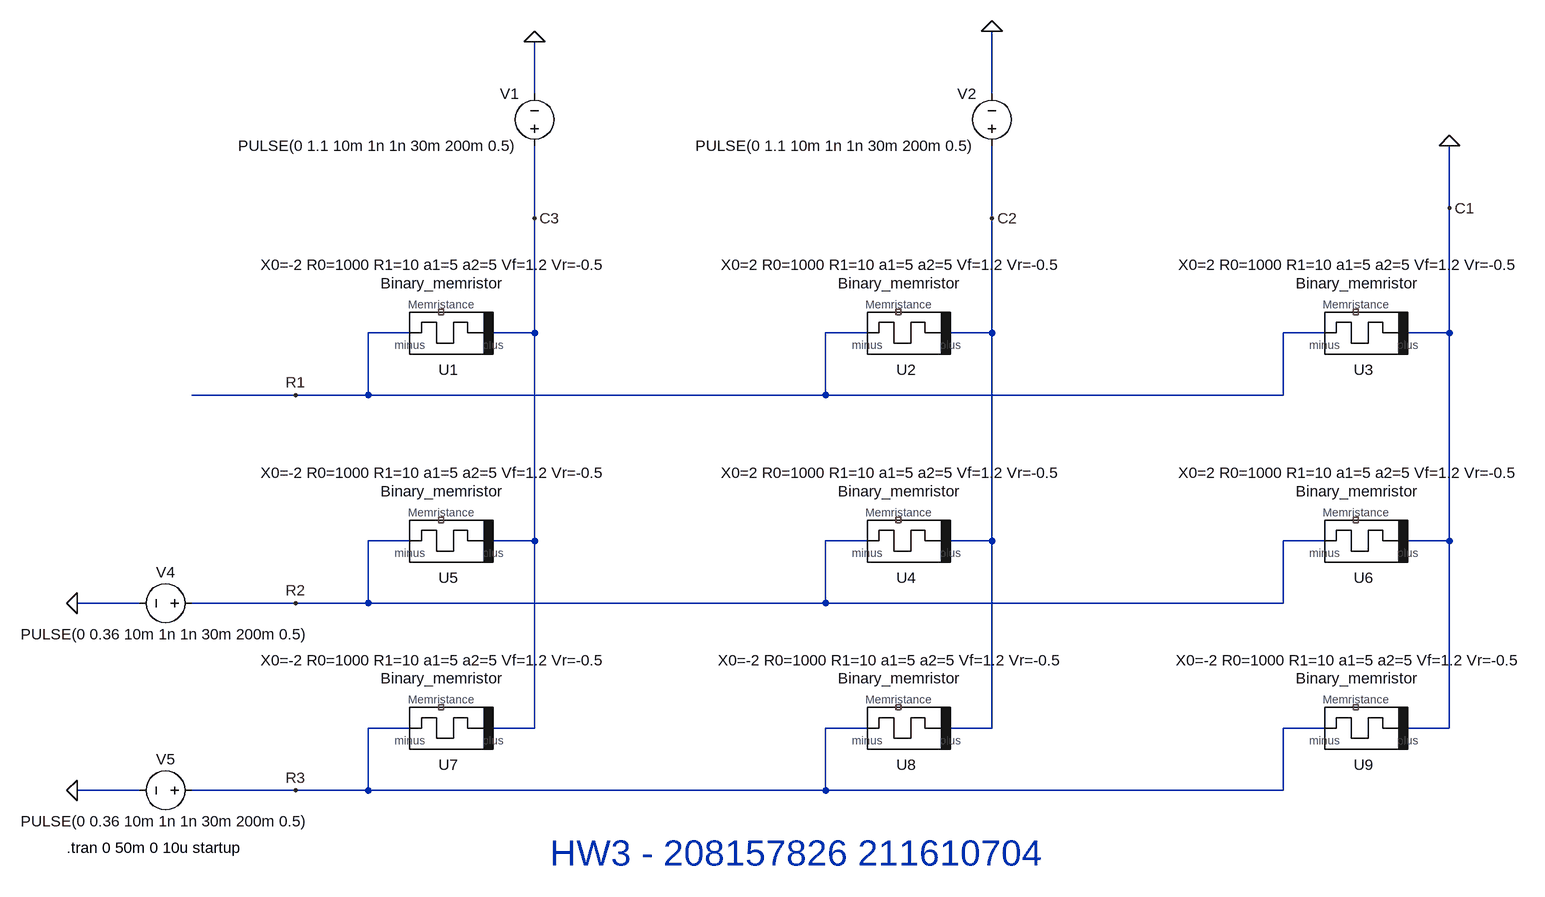
[diagram p0: schematic Q2_part_d.asc]
Q2_part_d.asc, the LTspice schematic file:
Version 4
SHEET 1 1956 900
WIRE 400 -304 400 -384
WIRE 1104 -304 1104 -400
WIRE 1808 -128 1808 -224
WIRE 400 -112 400 -224
WIRE 1104 -112 1104 -224
WIRE 208 64 144 64
WIRE 400 64 400 -112
WIRE 400 64 336 64
WIRE 912 64 848 64
WIRE 1104 64 1104 -112
WIRE 1104 64 1040 64
WIRE 1616 64 1552 64
WIRE 1808 64 1808 -128
WIRE 1808 64 1744 64
WIRE 32 160 -128 160
WIRE 144 160 144 64
WIRE 144 160 32 160
WIRE 848 160 848 64
WIRE 848 160 144 160
WIRE 1552 160 1552 64
WIRE 1552 160 848 160
WIRE 208 384 144 384
WIRE 400 384 400 64
WIRE 400 384 336 384
WIRE 912 384 848 384
WIRE 1104 384 1104 64
WIRE 1104 384 1040 384
WIRE 1616 384 1552 384
WIRE 1808 384 1808 64
WIRE 1808 384 1744 384
WIRE -208 480 -304 480
WIRE 32 480 -128 480
WIRE 144 480 144 384
WIRE 144 480 32 480
WIRE 848 480 848 384
WIRE 848 480 144 480
WIRE 1552 480 1552 384
WIRE 1552 480 848 480
WIRE 208 672 144 672
WIRE 400 672 400 384
WIRE 400 672 336 672
WIRE 912 672 848 672
WIRE 1104 672 1104 384
WIRE 1104 672 1040 672
WIRE 1616 672 1552 672
WIRE 1808 672 1808 384
WIRE 1808 672 1744 672
WIRE -208 768 -304 768
WIRE 32 768 -128 768
WIRE 144 768 144 672
WIRE 144 768 32 768
WIRE 848 768 848 672
WIRE 848 768 144 768
WIRE 1552 768 1552 672
WIRE 1552 768 848 768
FLAG 1808 -224 0
FLAG -304 480 0
FLAG -304 768 0
FLAG 400 -384 0
FLAG 1104 -400 0
FLAG 32 160 R1
FLAG 32 480 R2
FLAG 32 768 R3
FLAG 400 -112 C3
FLAG 1104 -112 C2
FLAG 1808 -128 C1
SYMBOL Binary 256 64 R180
SYMATTR InstName U1
SYMATTR SpiceLine X0=-2 R0=1000 R1=10 a1=5 a2=5 Vf=1.2 Vr=-0.5
SYMBOL Binary 960 64 R180
SYMATTR InstName U2
SYMATTR SpiceLine X0=2 R0=1000 R1=10 a1=5 a2=5 Vf=1.2 Vr=-0.5
SYMBOL Binary 1664 64 R180
SYMATTR InstName U3
SYMATTR SpiceLine X0=2 R0=1000 R1=10 a1=5 a2=5 Vf=1.2 Vr=-0.5
SYMBOL Binary 960 384 R180
SYMATTR InstName U4
SYMATTR SpiceLine X0=2 R0=1000 R1=10 a1=5 a2=5 Vf=1.2 Vr=-0.5
SYMBOL Binary 256 384 R180
SYMATTR InstName U5
SYMATTR SpiceLine X0=-2 R0=1000 R1=10 a1=5 a2=5 Vf=1.2 Vr=-0.5
SYMBOL Binary 1664 384 R180
SYMATTR InstName U6
SYMATTR SpiceLine X0=2 R0=1000 R1=10 a1=5 a2=5 Vf=1.2 Vr=-0.5
SYMBOL Binary 256 672 R180
SYMATTR InstName U7
SYMATTR SpiceLine X0=-2 R0=1000 R1=10 a1=5 a2=5 Vf=1.2 Vr=-0.5
SYMBOL Binary 960 672 R180
SYMATTR InstName U8
SYMATTR SpiceLine X0=-2 R0=1000 R1=10 a1=5 a2=5 Vf=1.2 Vr=-0.5
SYMBOL Binary 1664 672 R180
SYMATTR InstName U9
SYMATTR SpiceLine X0=-2 R0=1000 R1=10 a1=5 a2=5 Vf=1.2 Vr=-0.5
SYMBOL voltage 400 -208 R180
WINDOW 0 24 96 Left 2
WINDOW 3 24 16 Left 2
WINDOW 123 0 0 Left 0
WINDOW 39 0 0 Left 0
SYMATTR InstName V1
SYMATTR Value PULSE(0 1.1 10m 1n 1n 30m 200m 0.5)
SYMBOL voltage 1104 -208 R180
WINDOW 0 24 96 Left 2
WINDOW 3 24 16 Left 2
SYMATTR InstName V2
SYMATTR Value PULSE(0 1.1 10m 1n 1n 30m 200m 0.5)
SYMBOL voltage -112 480 R90
WINDOW 0 -32 56 VBottom 2
WINDOW 3 32 56 VTop 2
WINDOW 123 0 0 Left 0
WINDOW 39 0 0 Left 0
SYMATTR InstName V4
SYMATTR Value PULSE(0 0.36 10m 1n 1n 30m 200m 0.5)
SYMBOL voltage -112 768 R90
WINDOW 0 -32 56 VBottom 2
WINDOW 3 32 56 VTop 2
WINDOW 123 0 0 Left 0
WINDOW 39 0 0 Left 0
SYMATTR InstName V5
SYMATTR Value PULSE(0 0.36 10m 1n 1n 30m 200m 0.5)
TEXT 424 864 Left 5 ;HW3 - 208157826 211610704
TEXT -320 856 Left 2 !.tran 0 50m 0 10u startup

The netlist it stands for:
* Q2_part_d.asc
XU1 C3 R1 NC_01 Binary_memristor X0=-2 R0=1000 R1=10 a1=5 a2=5 Vf=1.2 Vr=-0.5  ; pins plus minus Memristance
XU2 C2 R1 NC_02 Binary_memristor X0=2 R0=1000 R1=10 a1=5 a2=5 Vf=1.2 Vr=-0.5  ; pins plus minus Memristance
XU3 0 R1 NC_03 Binary_memristor X0=2 R0=1000 R1=10 a1=5 a2=5 Vf=1.2 Vr=-0.5  ; pins plus minus Memristance
XU4 C2 R2 NC_04 Binary_memristor X0=2 R0=1000 R1=10 a1=5 a2=5 Vf=1.2 Vr=-0.5  ; pins plus minus Memristance
XU5 C3 R2 NC_05 Binary_memristor X0=-2 R0=1000 R1=10 a1=5 a2=5 Vf=1.2 Vr=-0.5  ; pins plus minus Memristance
XU6 0 R2 NC_06 Binary_memristor X0=2 R0=1000 R1=10 a1=5 a2=5 Vf=1.2 Vr=-0.5  ; pins plus minus Memristance
XU7 C3 R3 NC_07 Binary_memristor X0=-2 R0=1000 R1=10 a1=5 a2=5 Vf=1.2 Vr=-0.5  ; pins plus minus Memristance
XU8 C2 R3 NC_08 Binary_memristor X0=-2 R0=1000 R1=10 a1=5 a2=5 Vf=1.2 Vr=-0.5  ; pins plus minus Memristance
XU9 0 R3 NC_09 Binary_memristor X0=-2 R0=1000 R1=10 a1=5 a2=5 Vf=1.2 Vr=-0.5  ; pins plus minus Memristance
V1 C3 0 PULSE(0 1.1 10m 1n 1n 30m 200m 0.5)
V2 C2 0 PULSE(0 1.1 10m 1n 1n 30m 200m 0.5)
V4 R2 0 PULSE(0 0.36 10m 1n 1n 30m 200m 0.5)
V5 R3 0 PULSE(0 0.36 10m 1n 1n 30m 200m 0.5)
* HW3 - 208157826 211610704
.tran 0 50m 0 10u startup
.lib Binary.lib
.backanno
.end